# EAGLE design rundfunker (EAGLE 4.16)
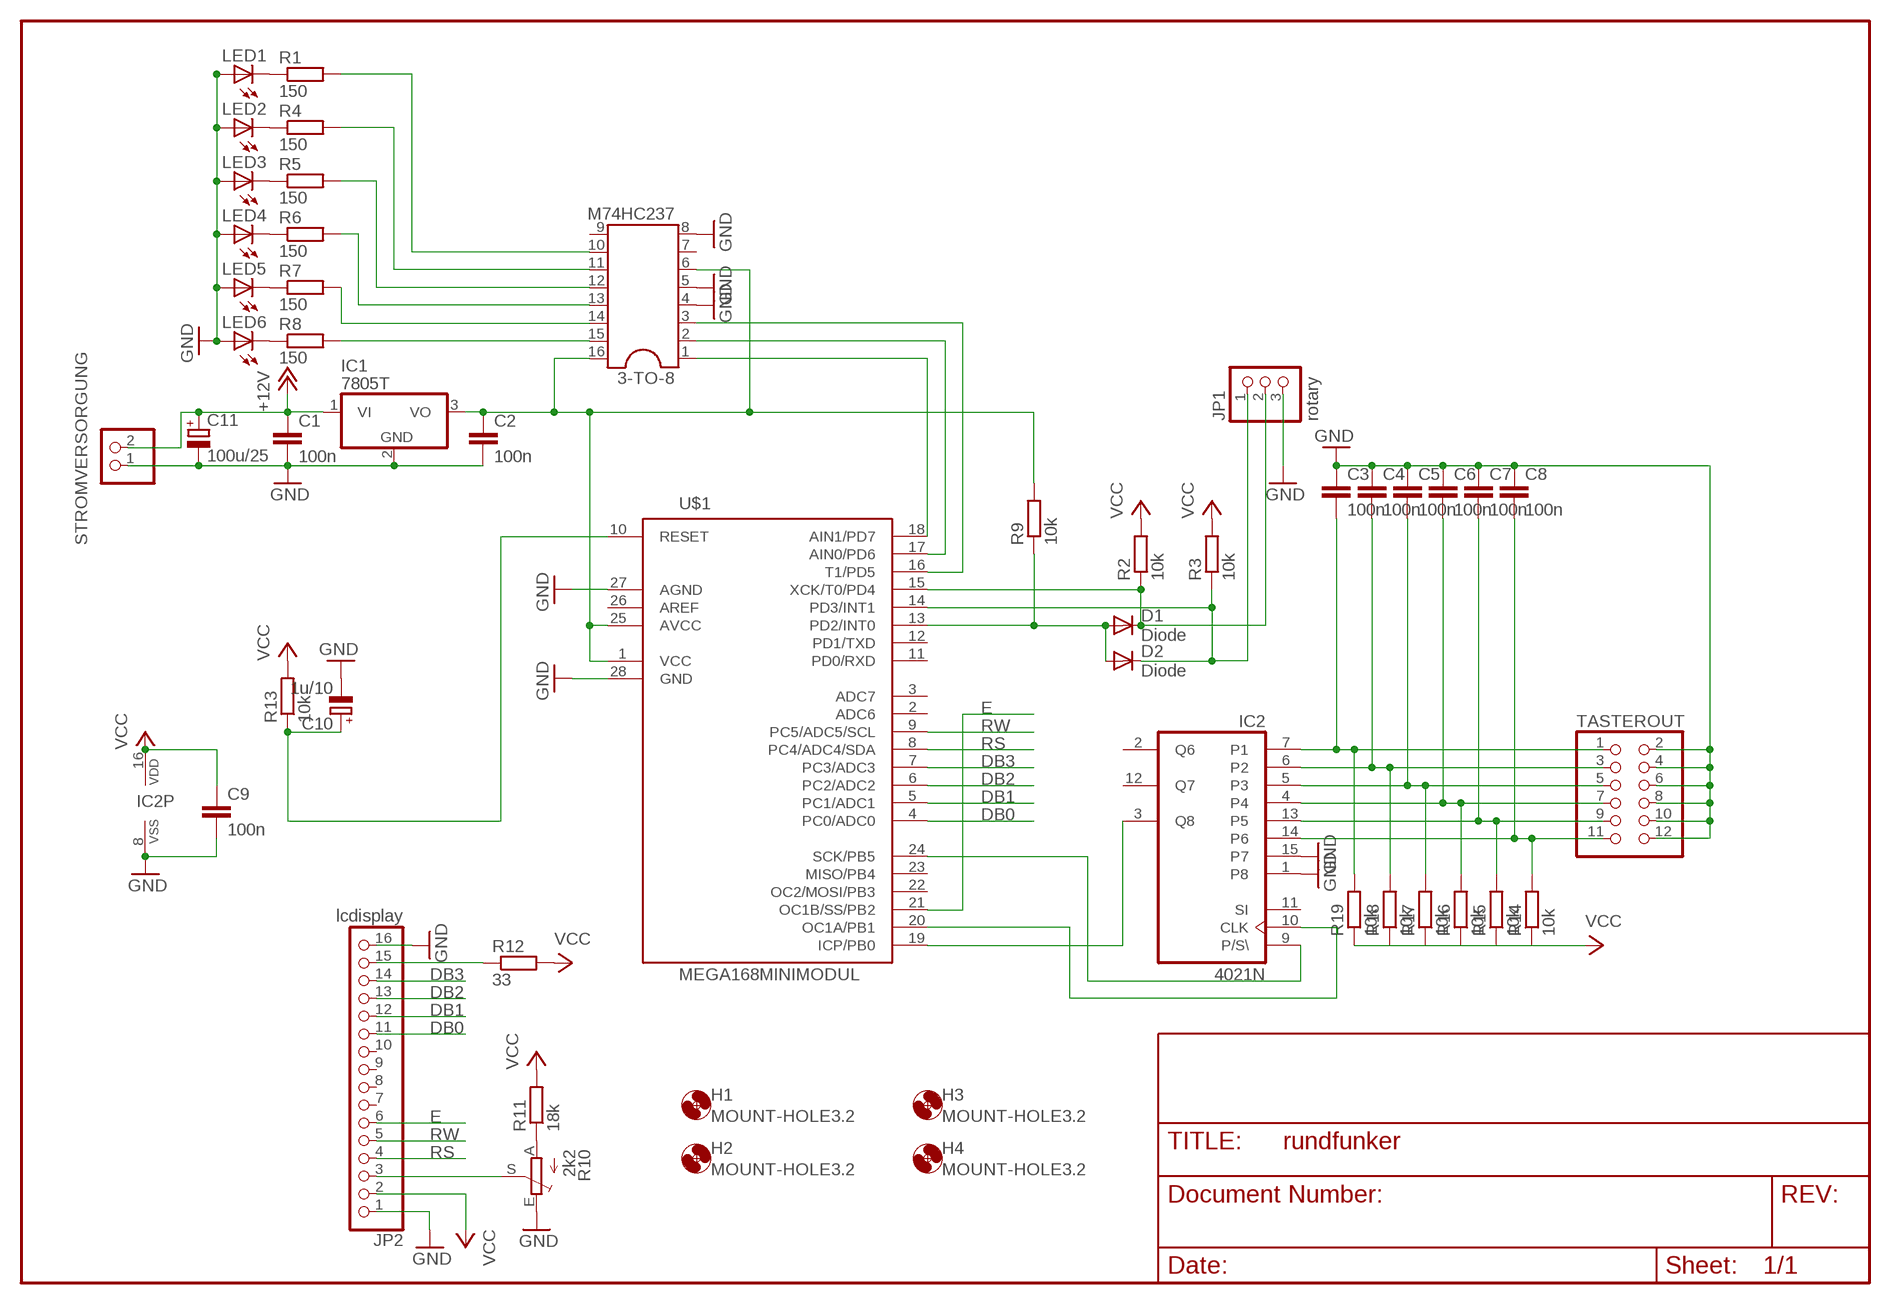
[diagram p0: schematic, sheet 1]

## Parts
3-TO-8  M74HC237  DIL16  [DIL16]
C1  100n  C-EU025-024X044  [C025-024X044]
C2  100n  C-EU025-024X044  [C025-024X044]
C3  100n  C-EU025-024X044  [C025-024X044]
C4  100n  C-EU025-024X044  [C025-024X044]
C5  100n  C-EU025-024X044  [C025-024X044]
C6  100n  C-EU025-024X044  [C025-024X044]
C7  100n  C-EU025-024X044  [C025-024X044]
C8  100n  C-EU025-024X044  [C025-024X044]
C9  100n  C-EU025-025X050  [C025-025X050]
C10  1u/10  CPOL-EUE2.5-5  [E2,5-5]
C11  100u/25  CPOL-EUE5-8.5  [E5-8,5]
D1  Diode  1N4004  [DO41-10]
D2  Diode  1N4004  [DO41-10]
H1  MOUNT-HOLE3.2  [3,2]
H2  MOUNT-HOLE3.2  [3,2]
H3  MOUNT-HOLE3.2  [3,2]
H4  MOUNT-HOLE3.2  [3,2]
IC1  7805T  [TO220H]
IC2  4021N  [DIL16]
JP1  rotary  PINHD-1X3  [1X03]
JP2  lcdisplay  PINHD-1X16  [1X16]
LED1  LED3MM  [LED3MM]
LED2  LED3MM  [LED3MM]
LED3  LED3MM  [LED3MM]
LED4  LED3MM  [LED3MM]
LED5  LED3MM  [LED3MM]
LED6  LED3MM  [LED3MM]
R1  150  R-EU_0204/5  [0204/5]
R2  10k  R-EU_0204/5  [0204/5]
R3  10k  R-EU_0204/5  [0204/5]
R4  150  R-EU_0204/5  [0204/5]
R5  150  R-EU_0204/5  [0204/5]
R6  150  R-EU_0204/5  [0204/5]
R7  150  R-EU_0204/5  [0204/5]
R8  150  R-EU_0204/5  [0204/5]
R9  10k  R-EU_0204/5  [0204/5]
R10  2k2  TRIM_EU-LI10  [LI10]
R11  18k  R-EU_0309/10  [0309/10]
R12  33  R-EU_0309/10  [0309/10]
R13  10k  R-EU_0204/5  [0204/5]
R14  10k  R-EU_0204/5  [0204/5]
R15  10k  R-EU_0204/5  [0204/5]
R16  10k  R-EU_0204/5  [0204/5]
R17  10k  R-EU_0204/5  [0204/5]
R18  10k  R-EU_0204/5  [0204/5]
R19  10k  R-EU_0204/5  [0204/5]
STROMVERSORGUNG  PINHD-1X2  [1X02]
TASTEROUT  PINHD-2X6  [2X06]
U$1  MEGA168MINIMODUL  MEGA8MINIMODUL  [MEGA8MM]

## Nets
+12V: C1.1 C11.+ IC1.1(VI) STROMVERSORGUNG.2
DB0: JP2.11 U$1.4(PC0/ADC0)
DB1: JP2.12 U$1.5(PC1/ADC1)
DB2: JP2.13 U$1.6(PC2/ADC2)
DB3: JP2.14 U$1.7(PC3/ADC3)
E: JP2.6 U$1.21(OC1B/SS/PB2)
GND: 3-TO-8.4 3-TO-8.5 3-TO-8.8 C1.2 C2.2 C3.1 C4.1 C5.1 C6.1 C7.1 C8.1 C9.2 C10.- C11.- IC1.2(GND) IC2.1(P8) IC2.8(VSS) IC2.15(P7) JP1.3 JP2.1 JP2.16 LED1.A LED2.A LED3.A LED4.A LED5.A LED6.A R10.E STROMVERSORGUNG.1 TASTEROUT.2 TASTEROUT.4 TASTEROUT.6 TASTEROUT.8 TASTEROUT.10 TASTEROUT.12 U$1.27(AGND) U$1.28(GND)
N$1: D1.C JP1.2 R2.1 U$1.15(XCK/T0/PD4)
N$2: D2.C JP1.1 R3.1 U$1.14(PD3/INT1)
N$3: D1.A D2.A R9.1 U$1.13(PD2/INT0)
N$4: C3.2 IC2.7(P1) R19.2 TASTEROUT.1
N$5: C4.2 IC2.6(P2) R18.2 TASTEROUT.3
N$6: C5.2 IC2.5(P3) R17.2 TASTEROUT.5
N$7: C6.2 IC2.4 R16.2 TASTEROUT.7
N$8: C7.2 IC2.13(P5) R15.2 TASTEROUT.9
N$9: C8.2 IC2.14(P6) R14.2 TASTEROUT.11
N$10: JP2.3 R10.S
N$11: LED1.K(C) R1.1
N$12: LED2.K(C) R4.1
N$13: LED3.K(C) R5.1
N$14: LED4.K(C) R6.1
N$15: LED5.K(C) R7.1
N$16: LED6.K(C) R8.1
N$17: 3-TO-8.1 U$1.18(AIN1/PD7)
N$18: 3-TO-8.15 R8.2
N$19: 3-TO-8.14 R7.2
N$20: 3-TO-8.13 R6.2
N$21: 3-TO-8.12 R5.2
N$22: 3-TO-8.11 R4.2
N$23: 3-TO-8.10 R1.2
N$24: 3-TO-8.2 U$1.17(AIN0/PD6)
N$25: 3-TO-8.3 U$1.16(T1/PD5)
N$26: IC2.10(CLK) U$1.20(OC1A/PB1)
N$27: IC2.3(Q8) U$1.19(ICP/PB0)
N$28: C10.+ R13.1 U$1.10(RESET)
N$30: R10.A R11.1
N$31: JP2.15 R12.1
N$33: IC2.9(P/S\) U$1.24(SCK/PB5)
RS: JP2.4 U$1.8(PC4/ADC4/SDA)
RW: JP2.5 U$1.9(PC5/ADC5/SCL)
VCC: 3-TO-8.6 3-TO-8.16 C2.1 C9.1 IC1.3(VO) IC2.16(VDD) JP2.2 R2.2 R3.2 R9.2 R11.2 R12.2 R13.2 R14.1 R15.1 R16.1 R17.1 R18.1 R19.1 U$1.1(VCC) U$1.25(AVCC)
Unconnected: 3-TO-8.7 3-TO-8.9 IC2.2(Q6) IC2.11(SI) IC2.12(Q7) JP2.7 JP2.8 JP2.9 JP2.10 U$1.2(ADC6) U$1.3(ADC7) U$1.11(PD0/RXD) U$1.12(PD1/TXD) U$1.22(OC2/MOSI/PB3) U$1.23(MISO/PB4)

## Power pins joined to a net without a drawn wire
AREF: U$1.26(AREF)

## Library data of the parts
3-TO-8 = ic-package:DIL16: Dual In Line
C1-C9 = rcl:C-EU: CAPACITOR, European symbol
C10 C11 = rcl:CPOL-EU: POLARIZED CAPACITOR, European symbol
D1 D2 = diode:1N4004: DIODE general purpose rectifier, 1 A
H1-H4 = holes:MOUNT-HOLE: MOUNTING HOLE with drill center marker
IC1 = linear:78*: Positive VOLTAGE REGULATOR Source: http://cache.national.com/ds/LM/LM78L05.pdf http://www.fairchildsemi.com/ds/LM/LM7805.pdf
IC2 = 40xx:4021: 8-bit static SHIFT REGISTER
JP1 = pinhead:PINHD-1X3: PIN HEADER
JP2 = pinhead:PINHD-1X16: PIN HEADER
LED1-LED6 = led:LED: LED OSRAM: - CHIPLED LG R971, LG N971, LY N971, LG Q971, LY Q971, LO R971, LY R971 LH N974, LH R974 LS Q976, LO Q976, LY Q976 LO Q996 - Hyper CHIPLED LW Q18S LB Q993, LB Q99A, LB R99A - SideLED LS A670, LO A670, LY A670, LG A670, LP A670 LB A673, LV A673, LT A673, LW A673 LH A674 LY A675 LS A676, LA A676, LO A676, LY A676, LW A676 LS A679, LY A679, LG A679 - Hyper Micro SIDELED® LS Y876, LA Y876, LO Y876, LY Y876 LT Y87S - SmartLED LW L88C, LW L88S LB L89C, LB L89S, LG L890 LS L89K, LO L89K, LY L89K LS L896, LA L896, LO L896, LY L896 - TOPLED LS T670, LO T670, LY T670, LG T670, LP T670 LSG T670, LSP T670, LSY T670, LOP T670, LYG T670 LG T671, LOG T671, LSG T671 LB T673, LV T673, LT T673, LW T673 LH T674 LS T676, LA T676, LO T676, LY T676, LB T676, LH T676, LSB T676, LW T676 LB T67C, LV T67C, LT T67C, LS T67K, LO T67K, LY T67K, LW E67C LS E67B, LA E67B, LO E67B, LY E67B, LB E67C, LV E67C, LT E67C LW T67C LS T679, LY T679, LG T679 LS T770, LO T770, LY T770, LG T770, LP T770 LB T773, LV T773, LT T773, LW T773 LH T774 LS E675, LA E675, LY E675, LS T675 LS T776, LA T776, LO T776, LY T776, LB T776 LHGB T686 LT T68C, LB T68C - Hyper Mini TOPLED® LB M676 - Mini TOPLED Santana® LG M470 LS M47K, LO M47K, LY M47K Source: http://www.osram.convergy.de/
R1-R9 R11-R19 = rcl:R-EU_: RESISTOR, European symbol
R10 = pot:TRIM_EU-: POTENTIOMETER
STROMVERSORGUNG = pinhead:PINHD-1X2: PIN HEADER
TASTEROUT = pinhead:PINHD-2X6: PIN HEADER
U$1 = Modules:MEGA8MINIMODUL: Mega8 Mini Modul RS232 und RS485 Embedit Mikrocontrollertechnik

## Board
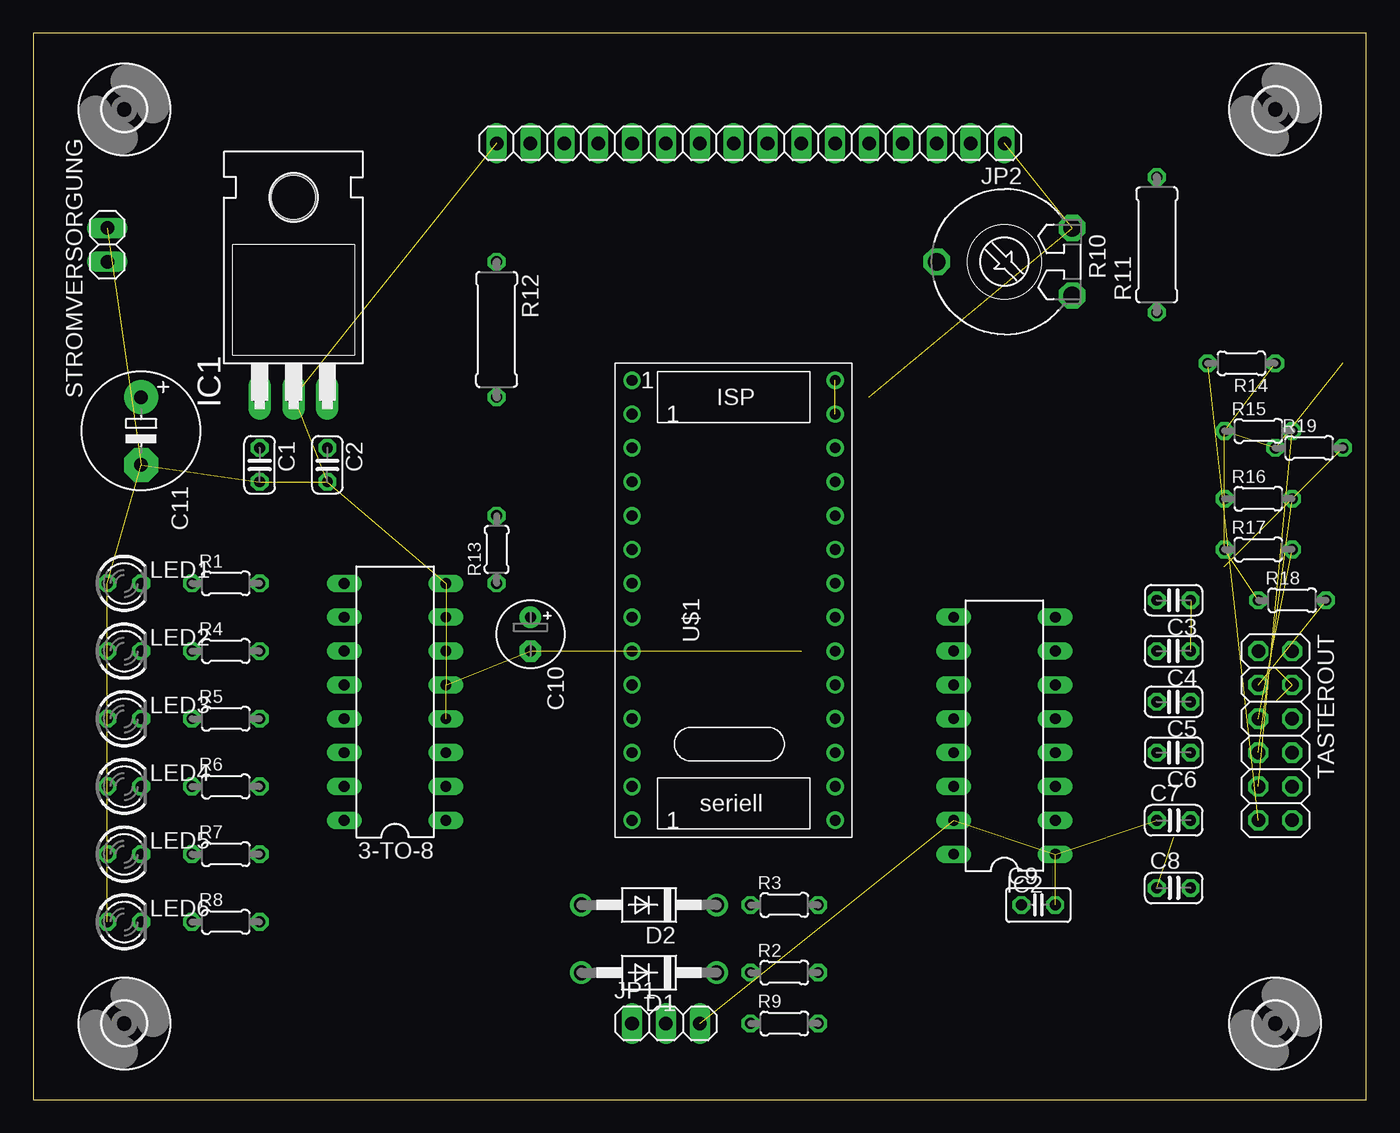
[diagram p1: board, top side]
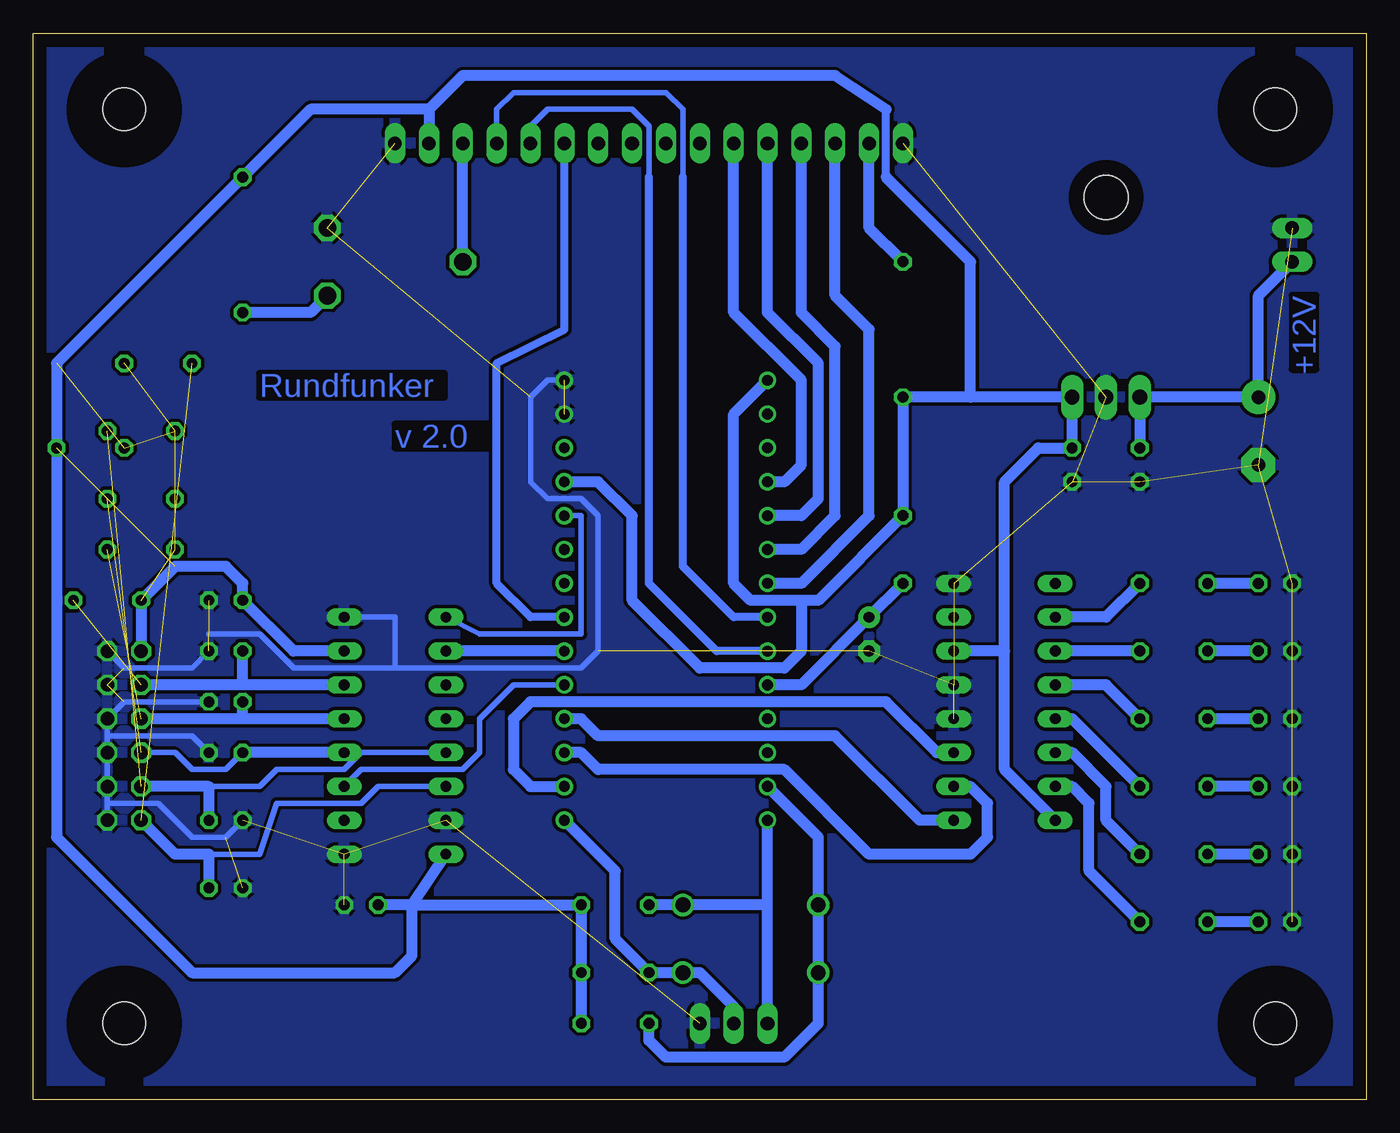
[diagram p2: board, bottom side, seen from below]

Size 100 x 80 mm. Coordinates in mm from the lower left corner, seen from the top.
Outline: 0,0 100,0 100,80 0,80 0,0
Copper layers (1*16): Top 0.035mm / dielectric 1.5mm / Bottom 0.035mm
Design rules "default": minimum track width 10mil, minimum drill 24mil, track to track 8mil, track to pad 8mil, pad to pad 8mil, via to via 8mil, smd to smd 8mil, copper to edge 40mil, drill to drill 8mil, minimum pad ring 10mil, minimum via ring 8mil, stop-mask expansion 4mil, vias tented up to drill 0mil, thermal gap 10mil

### Footprints (pad centres in the part's own frame; a part is rotated, then mirrored left to right if it is on the bottom)
DIL16 = drill 0.813 long: 1 -8.89,-3.81; 2 -6.35,-3.81; 3 -3.81,-3.81; 4 -1.27,-3.81; 5 1.27,-3.81; 6 3.81,-3.81; 7 6.35,-3.81; 8 8.89,-3.81; 9 8.89,3.81; 10 6.35,3.81; 11 3.81,3.81; 12 1.27,3.81; 13 -1.27,3.81; 14 -3.81,3.81; 15 -6.35,3.81; 16 -8.89,3.81
C025-024X044 = drill 0.813 octagon: 1 -1.27,0; 2 1.27,0
C025-025X050 = drill 0.813 octagon: 1 -1.27,0; 2 1.27,0
E2,5-5 = drill 0.813 pad 1.6 round: + -1.27,0 | drill 0.813 pad 1.6 octagon: - 1.27,0
E5-8,5 = drill 1.016 pad 2.54 round: + -2.54,0 | drill 1.016 pad 2.54 octagon: - 2.54,0
DO41-10 = drill 1.118 round: A 5.08,0; C -5.08,0
3,2 = hole 3.2: 0,0
TO220H = drill 1.118 long: 1 -2.54,-10.16; 2 0,-10.16; 3 2.54,-10.16 | hole 3.302: 0,4.826
1X03 = drill 1.016 long: 1 -2.54,0; 2 0,0; 3 2.54,0
1X16 = drill 1.016 long: 1 -19.05,0; 2 -16.51,0; 3 -13.97,0; 4 -11.43,0; 5 -8.89,0; 6 -6.35,0; 7 -3.81,0; 8 -1.27,0; 9 1.27,0; 10 3.81,0; 11 6.35,0; 12 8.89,0; 13 11.43,0; 14 13.97,0; 15 16.51,0; 16 19.05,0
LED3MM = drill 0.813 octagon: A -1.27,0; K 1.27,0
0204/5 = drill 0.813 octagon: 1 -2.54,0; 2 2.54,0
LI10 = drill 1.321 octagon: A -2.54,-5.08; E 2.54,-5.08; S 0,5.08
0309/10 = drill 0.813 octagon: 1 -5.08,0; 2 5.08,0
1X02 = drill 1.016 long: 1 -1.27,0; 2 1.27,0
2X06 = drill 1.016 octagon: 1 -6.35,-1.27; 2 -6.35,1.27; 3 -3.81,-1.27; 4 -3.81,1.27; 5 -1.27,-1.27; 6 -1.27,1.27; 7 1.27,-1.27; 8 1.27,1.27; 9 3.81,-1.27; 10 3.81,1.27; 11 6.35,-1.27; 12 6.35,1.27
MEGA8MM = drill 0.8 round: 1 -7.62,16.51; 2 -7.62,13.97; 3 -7.62,11.43; 4 -7.62,8.89; 5 -7.62,6.35; 6 -7.62,3.81; 7 -7.62,1.27; 8 -7.62,-1.27; 9 -7.62,-3.81; 10 -7.62,-6.35; 11 -7.62,-8.89; 12 -7.62,-11.43; 13 -7.62,-13.97; 14 -7.62,-16.51; 15 7.62,-16.51; 16 7.62,-13.97; 17 7.62,-11.43; 18 7.62,-8.89; 19 7.62,-6.35; 20 7.62,-3.81; 21 7.62,-1.27; 22 7.62,1.27; 23 7.62,3.81; 24 7.62,6.35; 25 7.62,8.89; 26 7.62,11.43; 27 7.62,13.97; 28 7.62,16.51

### Placement (x,y rotation side)
3-TO-8  27.14,29.84 90 top
C1  16.98,47.62 270 top
C2  22.06,47.62 270 top
C3  85.56,37.46 180 top
C4  85.56,33.65 180 top
C5  85.56,29.84 180 top
C6  85.56,26.03 180 top
C7  85.56,20.95 0 top
C8  85.56,15.87 0 top
C9  75.4,14.6 0 top
C10  37.3,34.92 270 top
C11  8.09,50.16 270 top
D1  46.19,9.52 180 top
D2  46.19,14.6 180 top
H1  6.82,5.71 0 top
H2  6.82,74.29 0 top
H3  93.18,74.29 0 top
H4  93.18,5.71 0 top
IC1  19.52,62.86 0 top
IC2  72.86,27.3 90 top
JP1  47.46,5.71 0 top
JP2  53.81,71.75 180 top
LED1  6.82,38.73 0 top
LED2  6.82,33.65 0 top
LED3  6.82,28.57 0 top
LED4  6.82,23.49 0 top
LED5  6.82,18.41 0 top
LED6  6.82,13.33 0 top
R1  14.44,38.73 0 top
R2  56.35,9.52 0 top
R3  56.35,14.6 0 top
R4  14.44,33.65 0 top
R5  14.44,28.57 0 top
R6  14.44,23.49 0 top
R7  14.44,18.41 0 top
R8  14.44,13.33 0 top
R9  56.35,5.71 0 top
R10  72.86,62.86 90 top
R11  84.29,64.13 90 top
R12  34.76,57.78 270 top
R13  34.76,41.27 90 top
R14  90.64,55.24 180 top
R15  91.91,50.16 0 top
R16  91.91,45.08 0 top
R17  91.91,41.27 0 top
R18  94.45,37.46 0 top
R19  95.72,48.89 0 top
STROMVERSORGUNG  5.55,64.13 270 top
TASTEROUT  93.18,27.3 270 top
U$1  52.54,37.46 0 top

### Tracks (layer width: path | path; a pad name or v marks a point on that pad's centre or on a via)
+12V
  Bottom 0.813: C1.1 IC1.1 C11.+ 8.09,60.32 STROMVERSORGUNG.2
DB0
  Bottom 0.813: JP2.11 47.46,59.05 42.38,53.97 42.38,47.62 43.65,46.35 U$1.4
DB1
  Bottom 0.813: JP2.12 44.92,59.05 41.11,55.24 41.11,45.08 42.38,43.81 U$1.5
DB2
  Bottom 0.813: JP2.13 42.38,59.05 39.84,56.51 39.84,43.81 42.38,41.27 U$1.6
DB3
  Bottom 0.813: JP2.14 39.84,60.32 37.3,57.78 37.3,43.81 42.38,38.73 U$1.7
E
  Bottom 0.61: U$1.21 62.7,36.19 65.24,38.73 65.24,55.24 60.16,57.78 JP2.6
GND  (28 unrouted)
  Bottom 0.406: IC2.8 72.86,36.19 72.86,32.38 | 86.83,34.92 83.02,34.92 80.48,32.38 72.86,32.38 | C4.1 88.1,32.38 93.18,32.38 TASTEROUT.2 | C5.1 93.18,29.84 TASTEROUT.6 94.45,27.3 | C6.1 88.1,27.3 94.45,27.3 | C7.1 85.56,19.68 88.1,19.68 90.64,22.22 94.45,22.22 | 94.45,22.22 TASTEROUT.12 | 94.45,27.3 TASTEROUT.8 TASTEROUT.10 94.45,22.22 | U$1.28 61.43,53.97 62.7,52.7 62.7,46.35 61.43,45.08 58.89,45.08 57.62,43.81 57.62,33.65 58.89,32.38 72.86,32.38
  pour Bottom (isolate 0.254): 0.47,79.37 99.53,79.37 99.53,0.63 0.47,0.63 0.47,78.1
N$1
  Bottom 0.813: U$1.15 56.35,17.14 56.35,12.06 R2.1 D1.C 50,9.52 47.46,6.98 JP1.2
N$2
  Bottom 0.813: 44.92,14.6 D2.C | 44.92,14.6 U$1.14 | 44.92,14.6 D2.C | JP1.1 44.92,14.6 | D2.C R3.1
N$3
  Bottom 0.813: R9.1 53.81,4.44 52.54,3.17 43.65,3.17 41.11,5.71 D1.A D2.A 41.11,19.68 U$1.13
N$4  (1 unrouted)
  Bottom 0.813: TASTEROUT.1 91.91,37.46 89.37,40 85.56,40 84.29,38.73 C3.2 80.48,33.65 IC2.7
N$5  (1 unrouted)
  Bottom 0.813: 84.29,31.11 TASTEROUT.3 | IC2.6 84.29,31.11 | 84.29,31.11 C4.2
N$6  (1 unrouted)
  Bottom 0.813: 84.29,28.57 TASTEROUT.5 | IC2.5 84.29,28.57 | 84.29,28.57 C5.2
N$7  (1 unrouted)
  Bottom 0.406: TASTEROUT.7 89.37,26.03 88.1,24.76 85.56,24.76 C6.2
  Bottom 0.813: IC2.4 C6.2
N$8  (1 unrouted)
  Bottom 0.406: IC2.13 75.4,26.03 76.67,24.76 81.75,24.76 83.02,23.49 86.83,23.49
  Bottom 0.813: C7.2 86.83,23.49 TASTEROUT.9
N$9  (1 unrouted)
  Bottom 0.406: IC2.14 74.13,23.49 75.4,22.22 81.75,22.22 83.02,18.41 86.83,18.41
  Bottom 0.813: TASTEROUT.11 89.37,18.41 86.83,18.41 C8.2
N$10
  Bottom 0.813: R10.S JP2.3
N$11
  Bottom 0.813: LED1.K R1.1
N$12
  Bottom 0.813: LED2.K R4.1
N$13
  Bottom 0.813: LED3.K R5.1
N$14
  Bottom 0.813: LED4.K R6.1
N$15
  Bottom 0.813: LED5.K R7.1
N$16
  Bottom 0.813: LED6.K R8.1
N$17
  Bottom 0.813: U$1.18 58.89,28.57 57.62,27.3 39.84,27.3 33.49,20.95 3-TO-8.1
N$18
  Bottom 0.813: R8.2 20.79,17.14 20.79,22.22 22.06,23.49 3-TO-8.15
N$19
  Bottom 0.813: R7.2 19.52,20.95 19.52,23.49 22.06,26.03 3-TO-8.14
N$20
  Bottom 0.813: R6.2 22.06,28.57 3-TO-8.13
N$21
  Bottom 0.813: R5.2 19.52,31.11 3-TO-8.12
N$22
  Bottom 0.813: R4.2 3-TO-8.11
N$23
  Bottom 0.813: R1.2 19.52,36.19 3-TO-8.10
N$24
  Bottom 0.813: 3-TO-8.2 29.68,23.49 28.41,22.22 28.41,19.68 29.68,18.41 37.3,18.41 43.65,24.76 57.62,24.76 58.89,26.03 U$1.17
N$25
  Bottom 0.813: U$1.16 62.7,23.49 63.97,24.76 63.97,28.57 62.7,29.84 36.03,29.84 32.22,26.03 3-TO-8.3
N$26
  Bottom 0.813: U$1.20 IC2.10
N$27
  Bottom 0.406: U$1.19 63.97,31.11 66.51,28.57 66.51,26.03 67.78,24.76 75.4,24.76 IC2.3
N$28
  Bottom 0.813: R13.1 C10.+ 42.38,31.11 U$1.10
N$30
  Bottom 0.813: R10.A 79.21,59.05 R11.1
N$31
  Bottom 0.813: R12.1 37.3,65.4 JP2.15
N$33
  Bottom 0.406: U$1.24 58.89,43.81 58.89,34.92 66.51,34.92 IC2.9
RS
  Bottom 0.406: 51.27,69.21 51.27,74.29 52.54,75.56 62.7,75.56 63.97,75.56 65.24,74.29 JP2.4
  Bottom 0.61: U$1.8 47.46,36.19 51.27,40 51.27,69.21
RW
  Bottom 0.406: 53.81,67.94 53.81,69.21 53.81,73.02 55.08,74.29 61.43,74.29 62.7,73.02 JP2.5
  Bottom 0.61: U$1.9 48.73,33.65 53.81,38.73 53.81,69.21
VCC  (6 unrouted)
  Bottom 0.61: 36.03,69.21 36.03,74.29
  Bottom 0.813: 3-TO-8.16 27.14,24.76 27.14,33.65 | 70.32,74.29 JP2.2 | 27.14,33.65 3-TO-8.6 | 29.68,52.7 R12.2 R13.2 41.11,37.46 42.38,37.46 | 71.59,14.6 C9.1 | 42.38,37.46 46.19,37.46 47.46,38.73 47.46,51.43 U$1.1 | U$1.25 57.62,46.35 55.08,43.81 55.08,37.46 50,32.38 43.65,32.38 42.38,33.65 42.38,37.46 | 29.68,52.7 IC1.3 C2.1 24.6,48.89 27.14,46.35 27.14,33.65 | 70.32,74.29 67.78,76.83 39.84,76.83 36.03,74.29 | 71.59,14.6 IC2.16 | 71.59,14.6 71.59,10.79 72.86,9.52 88.1,9.52 98.26,19.68 98.26,55.24 R11.2 79.21,74.29 70.32,74.29 | R9.2 R2.2 R3.2 71.59,14.6 | 29.68,52.7 29.68,62.86 36.03,69.21

### Text on the board
Bottom: +12V | Rundfunker | v 2.0